# Altium schematic sheet MANEA_TCAD_PROIECT_Sheet1.SchDoc (part 1 of 3)
size A; SheetNumber: 1; SheetTotal: 2
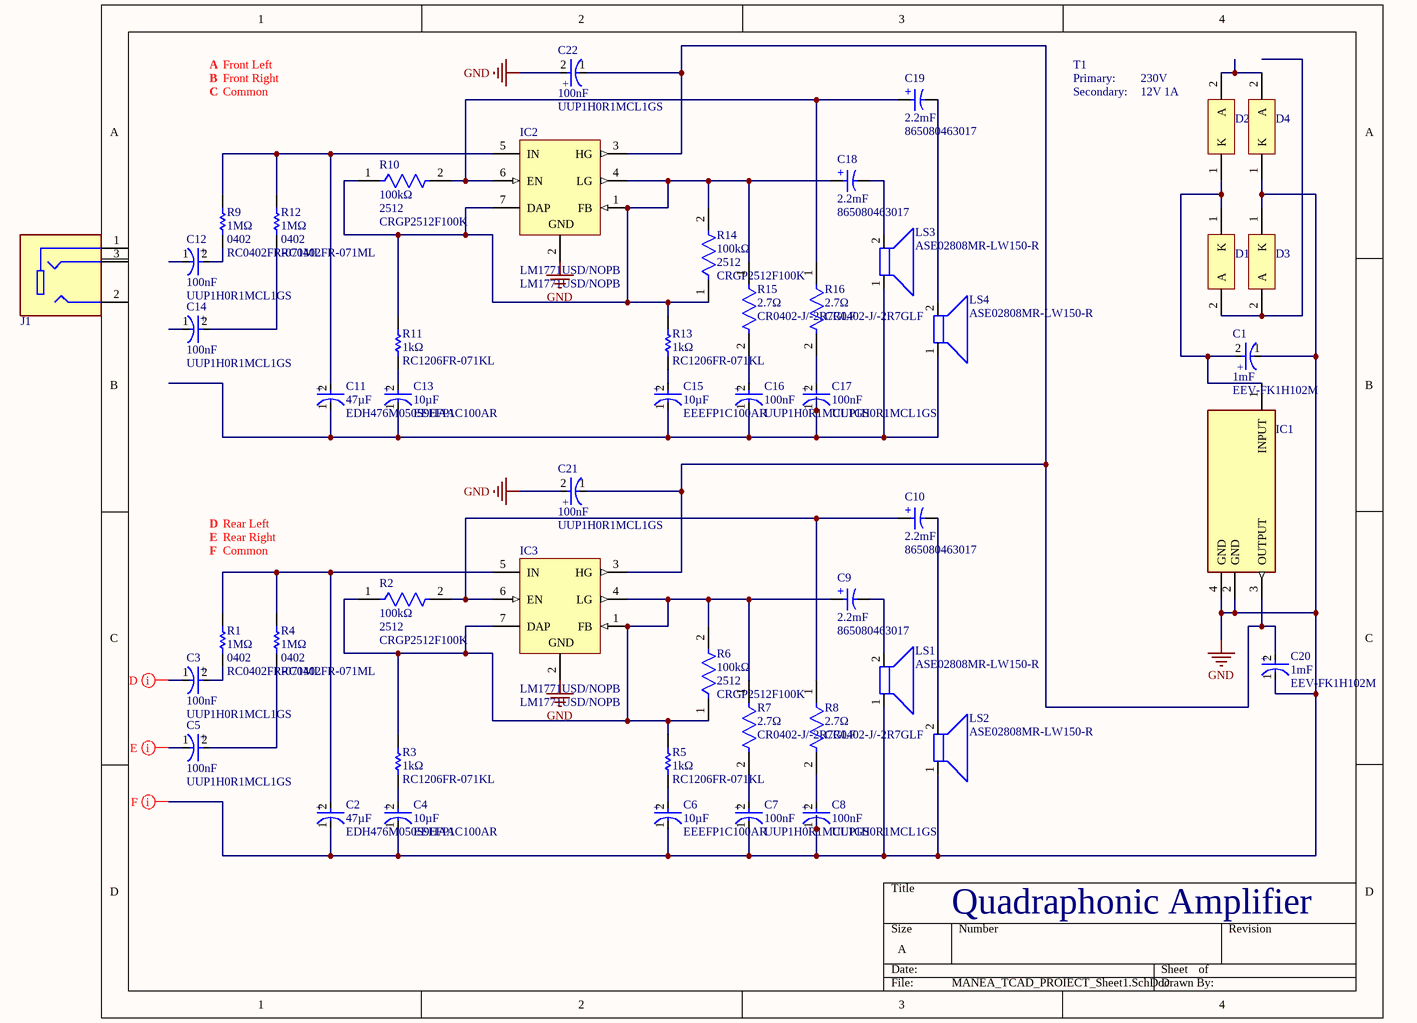
[diagram p0: MANEA_TCAD_PROIECT_Sheet1.SchDoc]

## Parts
C1  EEV-FK1H102M  value 1mF  [FP-FK-J16-MFG]
C2  EDH476M050S9HAA  value 47µF  [FP-EDH476M050S9HAA-IPC_A]
C3  UUP1H0R1MCL1GS  value 100nF  [FP-UUP1H0R1MCL1GS-MFG]
C4  EEEFP1C100AR  value 10µF  [FP-FPB-MFG]
C5  UUP1H0R1MCL1GS  value 100nF  [FP-UUP1H0R1MCL1GS-MFG]
C6  EEEFP1C100AR  value 10µF  [FP-FPB-MFG]
C7  UUP1H0R1MCL1GS  value 100nF  [FP-UUP1H0R1MCL1GS-MFG]
C8  UUP1H0R1MCL1GS  value 100nF  [FP-UUP1H0R1MCL1GS-MFG]
C9  865080463017  value 2.2mF  [WCAP-ASLI_D16H17]
C10  865080463017  value 2.2mF  [WCAP-ASLI_D16H17]
C11  EDH476M050S9HAA  value 47µF  [FP-EDH476M050S9HAA-IPC_A]
C12  UUP1H0R1MCL1GS  value 100nF  [FP-UUP1H0R1MCL1GS-MFG]
C13  EEEFP1C100AR  value 10µF  [FP-FPB-MFG]
C14  UUP1H0R1MCL1GS  value 100nF  [FP-UUP1H0R1MCL1GS-MFG]
C15  EEEFP1C100AR  value 10µF  [FP-FPB-MFG]
C16  UUP1H0R1MCL1GS  value 100nF  [FP-UUP1H0R1MCL1GS-MFG]
C17  UUP1H0R1MCL1GS  value 100nF  [FP-UUP1H0R1MCL1GS-MFG]
C18  865080463017  value 2.2mF  [WCAP-ASLI_D16H17]
C19  865080463017  value 2.2mF  [WCAP-ASLI_D16H17]
C20  EEV-FK1H102M  value 1mF  [FP-FK-J16-MFG]
C21  UUP1H0R1MCL1GS  value 100nF  [FP-UUP1H0R1MCL1GS-MFG]
C22  UUP1H0R1MCL1GS  value 100nF  [FP-UUP1H0R1MCL1GS-MFG]
D1  1N4001  [ONSC-AXIAL_LEAD-2-59-10_P]  (value not drawn)
D2  1N4001  [ONSC-AXIAL_LEAD-2-59-10_P]  (value not drawn)
D3  1N4001  [ONSC-AXIAL_LEAD-2-59-10_P]  (value not drawn)
D4  1N4001  [ONSC-AXIAL_LEAD-2-59-10_P]  (value not drawn)
IC1  LM7812SX/NOPB  [FP-KTT0003B-MFG]  (value not drawn)
IC2  LM1771USD/NOPB  [NGG0006A_V]
IC3  LM1771USD/NOPB  [NGG0006A_V]
J1  SJ1-3523N  [CUI_SJ1-3523N]  (value not drawn)
LS1  ASE02808MR-LW150-R  [FP-ASE02808MR-LW150-R-MFG]
LS2  ASE02808MR-LW150-R  [FP-ASE02808MR-LW150-R-MFG]
LS3  ASE02808MR-LW150-R  [FP-ASE02808MR-LW150-R-MFG]
LS4  ASE02808MR-LW150-R  [FP-ASE02808MR-LW150-R-MFG]
R1  RC0402FR-071ML  value 1MΩ  Case/Package: 0402  [RESC1005X40X25NL05T10]
R2  CRGP2512F100K  value 100kΩ  Case/Package: 2512  [FP-CRGP2512-IPC_A]
R3  RC1206FR-071KL  value 1kΩ  [RESC3116X65X40NL10T20]
R4  RC0402FR-071ML  value 1MΩ  Case/Package: 0402  [RESC1005X40X25NL05T10]
R5  RC1206FR-071KL  value 1kΩ  [RESC3116X65X40NL10T20]
R6  CRGP2512F100K  value 100kΩ  Case/Package: 2512  [FP-CRGP2512-IPC_A]
R7  CR0402-J/-2R7GLF  value 2.7Ω  [FP-CR0402-MFG]
R8  CR0402-J/-2R7GLF  value 2.7Ω  [FP-CR0402-MFG]
R9  RC0402FR-071ML  value 1MΩ  Case/Package: 0402  [RESC1005X40X25NL05T10]
R10  CRGP2512F100K  value 100kΩ  Case/Package: 2512  [FP-CRGP2512-IPC_A]
R11  RC1206FR-071KL  value 1kΩ  [RESC3116X65X40NL10T20]
R12  RC0402FR-071ML  value 1MΩ  Case/Package: 0402  [RESC1005X40X25NL05T10]
R13  RC1206FR-071KL  value 1kΩ  [RESC3116X65X40NL10T20]
R14  CRGP2512F100K  value 100kΩ  Case/Package: 2512  [FP-CRGP2512-IPC_A]
R15  CR0402-J/-2R7GLF  value 2.7Ω  [FP-CR0402-MFG]
R16  CR0402-J/-2R7GLF  value 2.7Ω  [FP-CR0402-MFG]

## Nets
GND: C1.1(C) C2.1(C) C4.1(C) C6.1(C) C7.1(C) C8.1(C) C20.1(C) C21.2(A) C22.2(A) D3.1(K) D4.1(K) IC1.2(GND) IC1.4(GND) IC2.2(GND) IC3.2(GND) LS1.1 LS2.1
NetC1_2: C1.2(A) D1.1(K) D2.1(K) IC1.1(INPUT)
NetC2_2: C2.2(A) IC3.5(IN) R1.2 R4.2
NetC3_2: C3.2(A) R1.1
NetC4_2: C4.2(A) R3.1
NetC5_2: C5.2(A) R4.1
NetC6_2: C6.2(A) R5.1
NetC7_2: C7.2(A) R7.2
NetC8_2: C8.2(A) R8.2
NetC9_1: C9.1(P) IC3.1(FB) IC3.4(LG) IC3.7(DAP) R2.1 R3.2 R5.2 R6.1 R6.2 R7.1
NetC9_2: C9.2(N) LS1.2
NetC10_1: C10.1(P) IC3.6(EN) R2.2 R8.1
NetC10_2: C10.2(N) LS2.2
NetC11_1: C11.1(C) C13.1(C) C15.1(C) C16.1(C) C17.1(C) LS3.1 LS4.1
NetC11_2: C11.2(A) IC2.5(IN) R9.2 R12.2
NetC12_2: C12.2(A) R9.1
NetC13_2: C13.2(A) R11.1
NetC14_2: C14.2(A) R12.1
NetC15_2: C15.2(A) R13.1
NetC16_2: C16.2(A) R15.2
NetC17_2: C17.2(A) R16.2
NetC18_1: C18.1(P) IC2.1(FB) IC2.4(LG) IC2.7(DAP) R10.1 R11.2 R13.2 R14.1 R14.2 R15.1
NetC18_2: C18.2(N) LS3.2
NetC19_1: C19.1(P) IC2.6(EN) R10.2 R16.1
NetC19_2: C19.2(N) LS4.2
NetC20_2: C20.2(A) C21.1(C) C22.1(C) IC1.3(OUTPUT) IC2.3(HG) IC3.3(HG)
NetD1_2: D1.2(A) D3.2(A)
NetD2_2: D2.2(A) D4.2(A)

Not connected (* = marked no-connect by the designer): C3 1(C); C5 1(C); C12 1(C); C14 1(C); J1 1 2 3

## Layout directives
mark named D: NetC3_1
mark named E: NetC5_1
mark named F: GND

## Notes on the sheet
- A
- B
- C
- Front Left
- Front Right
- Common
- T1
- Primary:
- Secondary:
- 230V
- (near D2) 12V 1A
- D
- E
- F
- Rear Left
- Rear Right
- Quadraphonic Amplifier
- (in symbol 865080463017) +
- (in symbol EDH476M050S9HAA) +
- (in symbol EEEFP1C100AR) +
- (in symbol EEV-FK1H102M) +
- (in symbol UUP1H0R1MCL1GS) +